# Altium schematic sheet 24P_TO_15P_FPC_CSI_ADAPTER.SchDoc
size A4; SheetNumber: 1; SheetTotal: 1
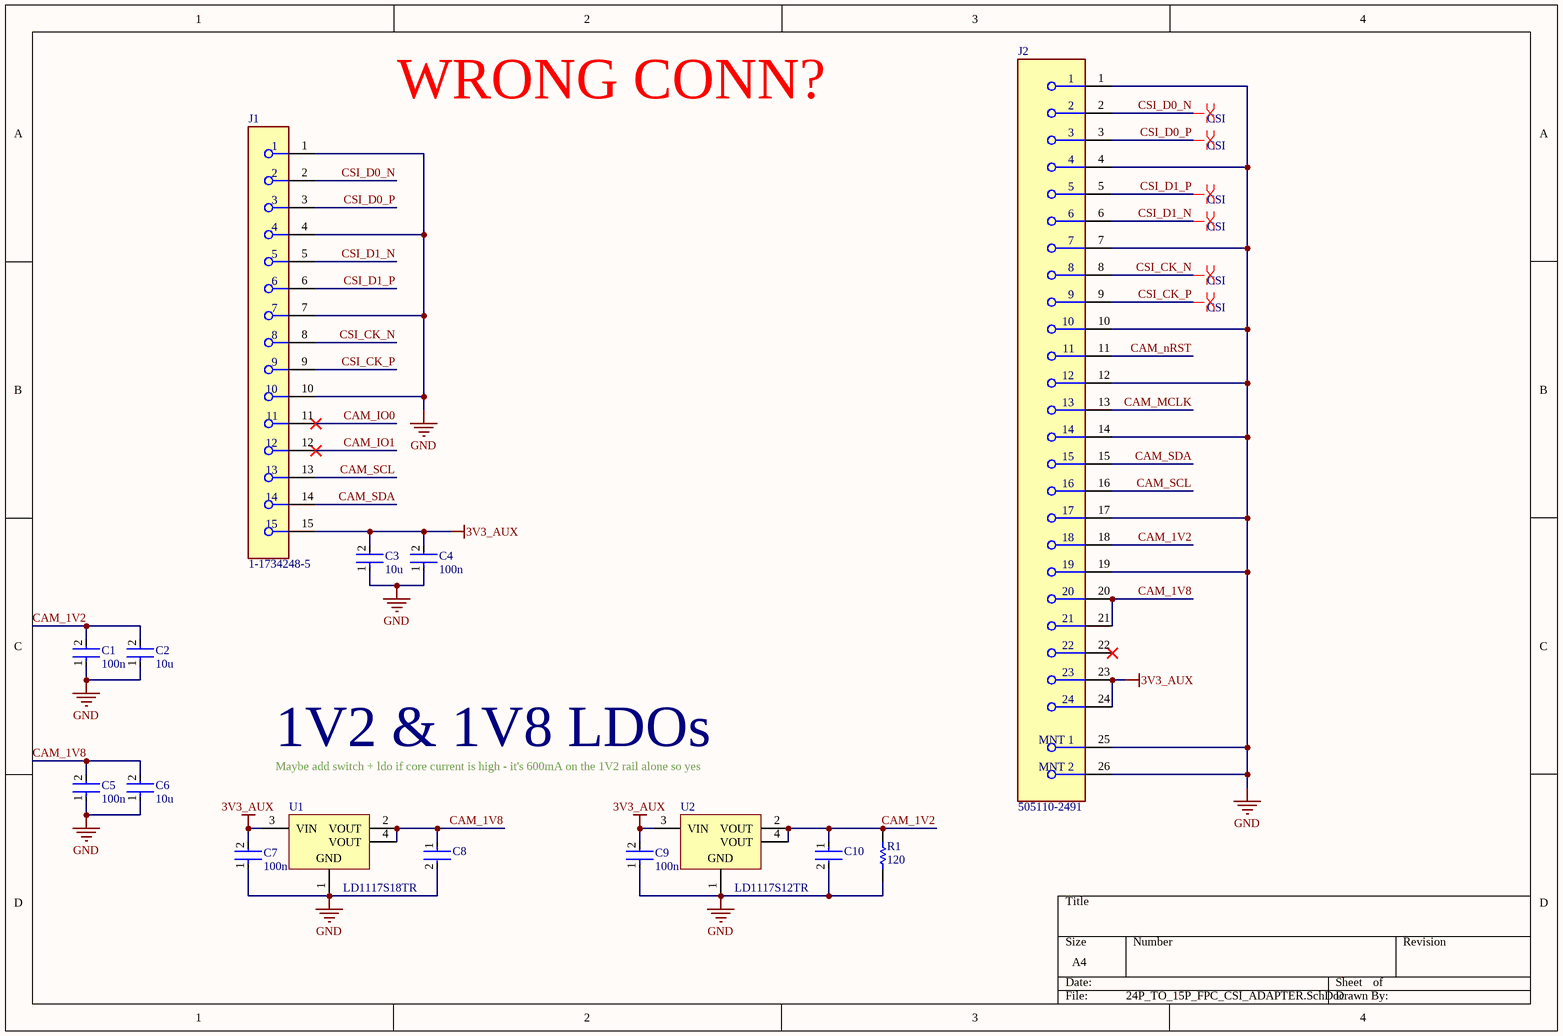
[diagram p0: 24P_TO_15P_FPC_CSI_ADAPTER.SchDoc]

## Parts
C1  100n  [FP-0402-L_1_0_0_05-W_0_5-IPC_A]
C2  10u  [FP-0402-L_1_0_0_05-W_0_5-IPC_A]
C3  10u  [FP-0402-L_1_0_0_05-W_0_5-IPC_A]
C4  100n  [FP-0402-L_1_0_0_05-W_0_5-IPC_A]
C5  100n  [FP-0402-L_1_0_0_05-W_0_5-IPC_A]
C6  10u  [FP-0402-L_1_0_0_05-W_0_5-IPC_A]
C7  100n  [FP-0402-L_1_0_0_05-W_0_5-IPC_A]
C8  GRM188R60J106ME47D  [FP-GRM188-0_1-e0_2_0_55-IPC_A]  (value not drawn)
C9  100n  [FP-0402-L_1_0_0_05-W_0_5-IPC_A]
C10  GRM188R60J106ME47D  [FP-GRM188-0_1-e0_2_0_55-IPC_A]  (value not drawn)
J1  1-1734248-5  [FP-1-1734248-5-MFG]
J2  505110-2491  [FP-505110-2491-MFG]
R1  120  [R0603B]
U1  LD1117S18TR  [SOT-223_M]
U2  LD1117S12TR  [SOT-223_M]

## Nets
3V3_AUX: C3.2 C4.2 C7.2 C9.2 J1.15 J2.23 J2.24 U1.3(VIN) U2.3(VIN)
GND: C1.1 C2.1 C3.1 C4.1 C5.1 C6.1 C7.1 C8.2 C9.1 C10.2 J1.1 J1.4 J1.7 J1.10 J2.1 J2.4 J2.7 J2.10 J2.12 J2.14 J2.17 J2.19 J2.25(MNT_1) J2.26(MNT_2) R1.1 U1.1(GND) U2.1(GND)
CAM_1V2: C1.2 C2.2 C10.1 J2.18 R1.2 U2.2(VOUT) U2.4(VOUT)
CAM_1V8: C5.2 C6.2 C8.1 J2.20 J2.21 U1.2(VOUT) U1.4(VOUT)
CAM_IO0: J1.11
CAM_IO1: J1.12
CAM_MCLK: J2.13
CAM_nRST: J2.11
CAM_SCL: J1.13 J2.16
CAM_SDA: J1.14 J2.15
CSI_CK_N: J1.8 J2.8
CSI_CK_P: J1.9 J2.9
CSI_D0_N: J1.2 J2.2
CSI_D0_P: J1.3 J2.3
CSI_D1_N: J1.5 J2.6
CSI_D1_P: J1.6 J2.5

Not connected (* = marked no-connect by the designer): J2 22*

## Layout directives
differential pair; differential pair class CSI: CSI_CK_N, CSI_CK_P, CSI_D0_N, CSI_D0_P, CSI_D1_N, CSI_D1_P

## Notes on the sheet
- WRONG CONN?
- 1V2 & 1V8 LDOs
- Maybe add switch + ldo if core current is high - it's 600mA on the 1V2 rail alone so yes

## Library data of the parts
C1-C7 C9 = CMP-001-00058-1: LARGE PADS, 0402 CAP, CHANGE COMMENT TO MATCH REAL P/N; Capacitor Type: Ceramic; Min Operating Temperature: -55°C; Mounting Technology: Surface Mount; Pins: 2; Case/Package: 0402; RoHS Compliant: Yes; Max Operating Temperature: 85°C
C8 C10 = CMP-2006-02792-2: Chip Multilayer Ceramic Capacitors for General Purpose, 0603, 10uF, X5R, 15%, 20%, 6.3V; Packaging: Tape and Reel; Voltage Rating (DC): 6.3V; Width: 0.031inch; Termination: SMD/SMT; Dielectric: X5R; Package Quantity: 4000; Voltage Rating: 6.3V; Capacitance: 10uF; Case/Package: 0603; Min Operating Temperature: -55°C; Voltage: 6.3V; Length: 1.6mm; Thickness: 0.035inch; Lead Free: Lead Free; Depth: 0.8mm; Case Code (Imperial): 0603; Max Operating Temperature: 85°C; Material: Ceramic; Height: 0.8mm; Tolerance: 20%; Mount: Surface Mount; REACH SVHC: No SVHC; Radiation Hardening: No; Case Code (Metric): 1608
J1 = CMP-03368-000001-1: CONN FPC VERT 15POS 1.00MM SMD; Manufacturer: TE; Conn Orientation: Vertical; Conn Gender: Female; Current Rating: 1A; Is Female: yes; Number Of Contacts: 15; Pitch: 1mm; Voltage Rating: 125V; ComponentLink2URL: https://www.te.com/commerce/DocumentDelivery/DDEController?Action=showdoc&DocId=Customer+Drawing%7F1734248%7FE1%7Fpdf%7FEnglish%7FENG_CD_1734248_E1__.pdf%7F1-1734248-5; Device Class L1: Connectors; Category: Conn; Package: 0; Lead Free: Yes; Digikey Description: CONN FPC VERT 15POS 1.00MM SMD; Height: 8mm; Manufacturer Part Number: 1-1734248-5; Temperature: -20°C to +85°C; Contact Material: Gold,Nickel; Device Class L3: unset; ComponentLink2Description: Datasheet; RoHS: TRUE; Temperature Range Low: -20°C; Octopart: https://octopart.com/1-1734248-5-te+connectivity-40620898; Device Class L2: FFC / FPC; Mouser Description: FFC & FPC Connectors 15P 1.0 FPC, Zip V/T SMT; Automotive: No; Temperature Range High: +85°C; Mounting Type: Surface Mount
J2 = CMP-04775-000015-1: CONN FFC/FPC BOTTOM 24P .5MM R/A; Mating Cycles: 25; Actuator Material: Nylon; Voltage Rating: 50V; Number of Contacts: 24; Gender: Receptacle; Actuator Color: Black; Current Rating: 500mA; Pitch: 0.5mm; Orientation: Right Angle; Contact Material: Bronze; Height: 1.9mm; Halogen Free: Low Halogen; Housing Color: Beige; Mount: Surface Mount; Packaging: Cut Tape; Contact Plating: Gold; Termination: Solder; Number of Pins: 24; Number of Rows: 1; Series: Easy-On FD19 505110; Housing Material: Polymer; Number of Positions: 24; Max Operating Temperature: 105°C; Number of Circuits: 24; Min Operating Temperature: -40°C; Flammability Rating: UL94 V-0
R1 = CMP-009-00002-14: Resistor
U1 = CMP-0244-00308-1: Fixed Low Drop Positive Voltage Regulator, 1.8V, 4-Pin SOT-223, Tape and Reel; ComponentLink1URL: http://www.st.com; PackageReference: SOT-223; PackageDescription: 4-Pin SOT-223 Package, 6.5 x 3.5 mm Body, 2.3 mm Pitch, 7 mm Lead Span; ComponentLink2URL: http://www.st.com/internet/com/TECHNICAL_RESOURCES/TECHNICAL_LITERATURE/DATASHEET/CD00000544.pdf; ComponentLink2Description: Datasheet; ComponentLink1Description: Manufacturer URL; DatasheetVersion: 1/11/2011; PackageVersion: 2010
U2 = CMP-0244-00318-1: Fixed Low Drop Positive Voltage Regulator, 1.2V, 4-Pin SOT-223, Tape and Reel; PackageDescription: 4-Pin SOT-223 Package, 6.5 x 3.5 mm Body, 2.3 mm Pitch, 7 mm Lead Span; PackageVersion: 2010; ComponentLink2Description: Datasheet; PackageReference: SOT-223; ComponentLink2URL: http://www.st.com/internet/com/TECHNICAL_RESOURCES/TECHNICAL_LITERATURE/DATASHEET/CD00000544.pdf; ComponentLink1Description: Manufacturer URL; DatasheetVersion: 1/11/2011; ComponentLink1URL: http://www.st.com